# EAGLE design DP6037_SMT.v1 (EAGLE 5.07)
PROJECT: DP6037 SMD v1
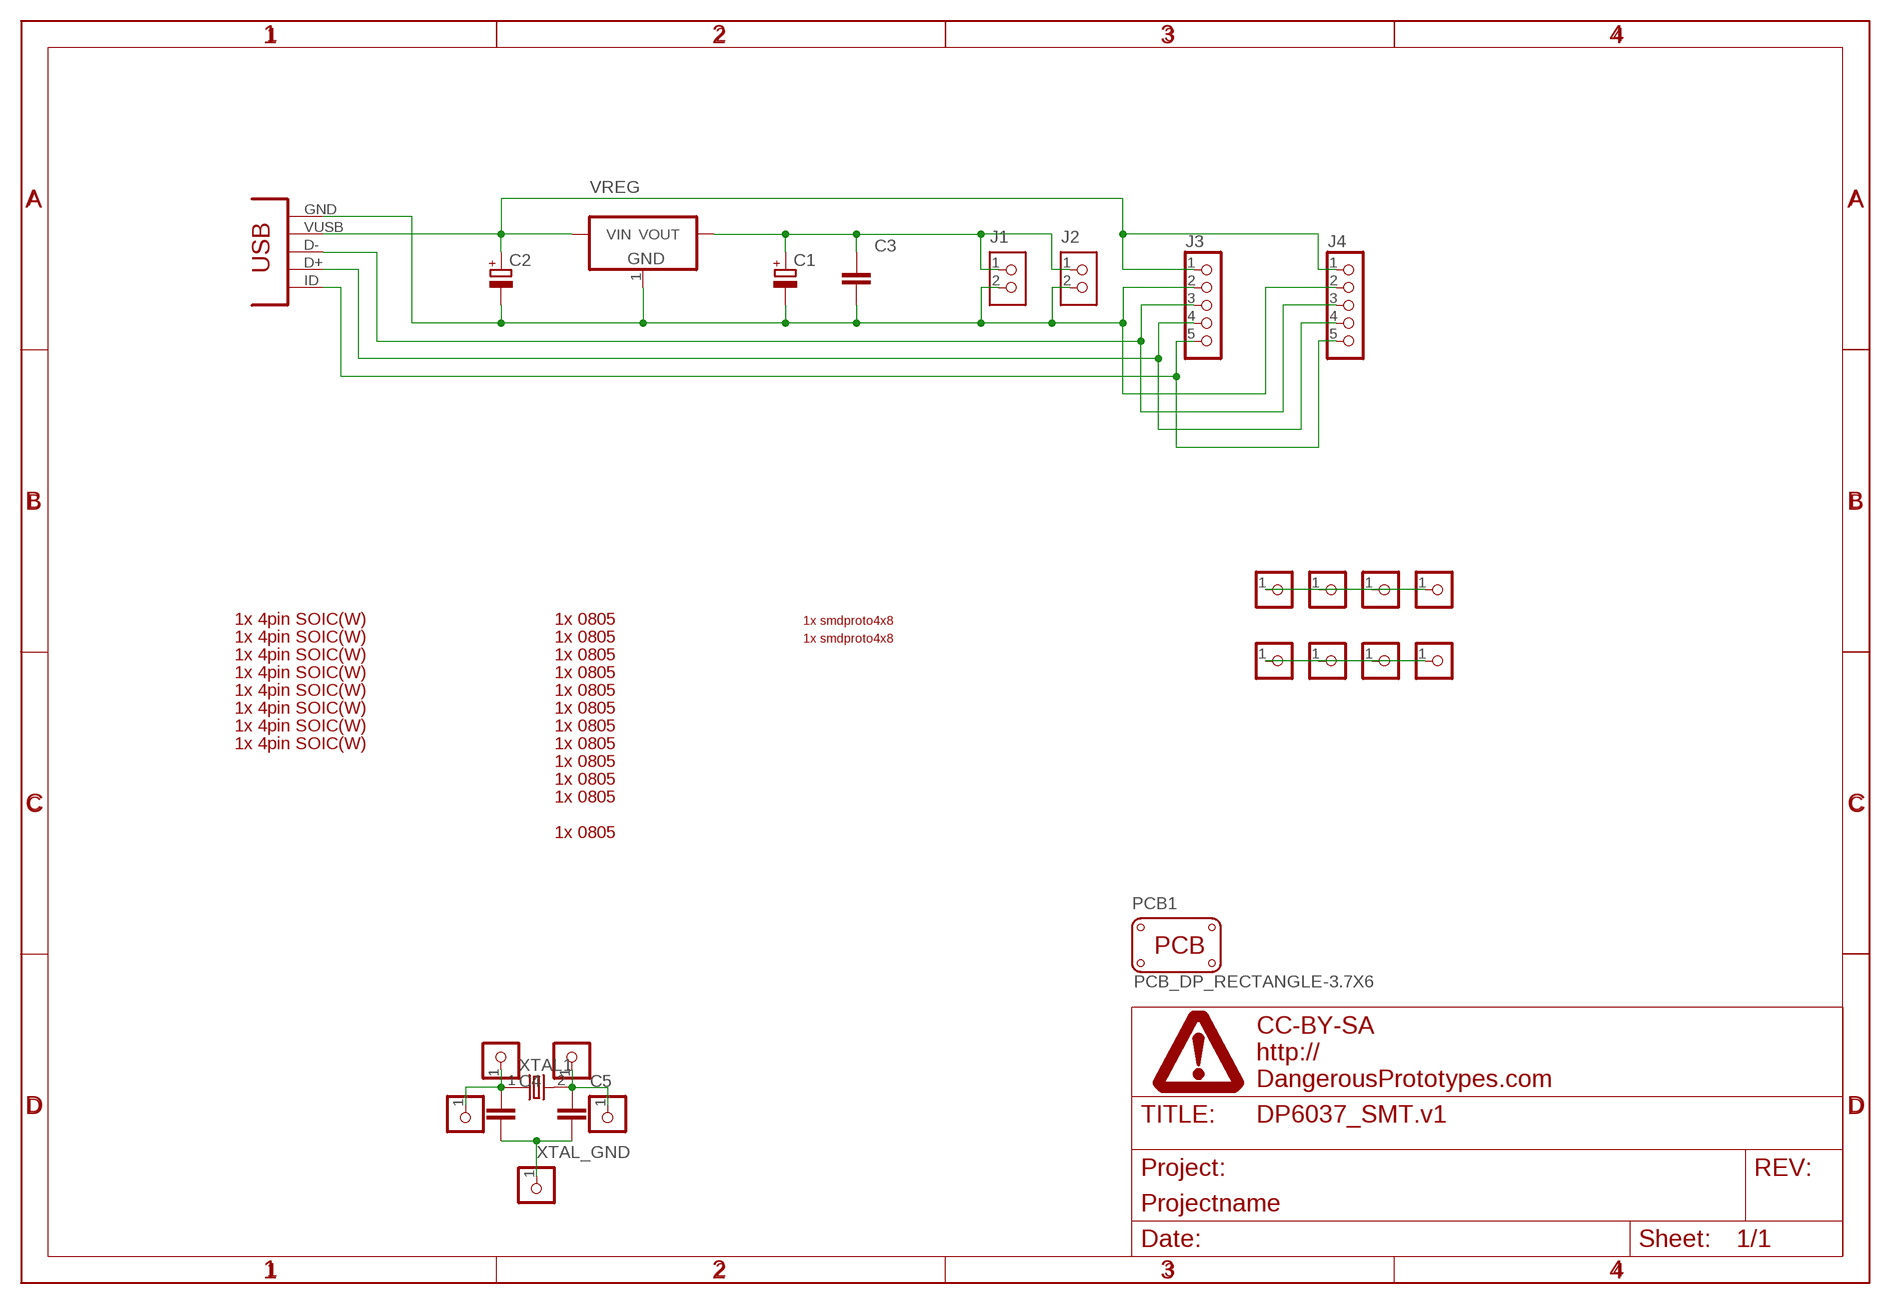
[diagram p0: schematic, sheet 1]

## Parts
C1  CAPACITOR_POL-SMC_A  [SMC_A]
C2  CAPACITOR_POL-SMC_A  [SMC_A]
C3  CAPACITOR_NPOL-0805  [C805]
C4  CAPACITOR_NPOL-0805  [C805]
C5  CAPACITOR_NPOL-0805  [C805]
J1  CON_HEADER_1X02-PTH  [M1X2]
J2  CON_HEADER_1X02-PTH  [M1X2]
J3  CON_HEADER_1X05-PTH  [M1X5]
J4  CON_HEADER_1X05-PTH  [M1X5]
J5  CON_HEADER_1X01-PTH  [M1X1]
J6  CON_HEADER_1X01-PTH  [M1X1]
J7  CON_HEADER_1X01-PTH  [M1X1]
J8  CON_HEADER_1X01-PTH  [M1X1]
J9  CON_HEADER_1X01-PTH  [M1X1]
J10  CON_HEADER_1X01-PTH  [M1X1]
J11  CON_HEADER_1X01-PTH  [M1X1]
J12  CON_HEADER_1X01-PTH  [M1X1]
J13  CON_HEADER_1X01-PTH_10_17  [M1X2_10_17]
J14  CON_HEADER_1X01-PTH_10_17  [M1X2_10_17]
J15  CON_HEADER_1X01-PTH_10_17  [M1X2_10_17]
J16  CON_HEADER_1X01-PTH_08_17  [M1X2_08_17]
J17  CON_HEADER_1X01-PTH_08_17  [M1X2_08_17]
PCB1  PCB_DP_RECTANGLE-3.7X6  PCB_DP_RECTANGLE-37X60  [DP6037_V1]
U$1  FRAME_DINA4_L  [DP_LOGO]
U$3  BB_SOICW  [BB_SOIC]
U$4  BB_SOICW  [BB_SOIC]
U$5  BB_SOICW  [BB_SOIC]
U$6  BB_SOICW  [BB_SOIC]
U$7  BB_SOICW  [BB_SOIC]
U$8  BB_SOICW  [BB_SOIC]
U$9  BB_SOICW  [BB_SOIC]
U$10  BB_SOICW  [BB_SOIC]
U$12  SMDPROTO4X8  [SMDPROTO4X8]
U$13  SMDPROTO4X8  [SMDPROTO4X8]
U$14  BB_RC0805  [BB_RC0805]
U$15  BB_RC0805  [BB_RC0805]
U$16  BB_RC0805  [BB_RC0805]
U$17  BB_RC0805  [BB_RC0805]
U$18  BB_RC0805  [BB_RC0805]
U$19  BB_RC0805  [BB_RC0805]
U$20  BB_RC0805  [BB_RC0805]
U$21  BB_RC0805  [BB_RC0805]
U$22  BB_RC0805  [BB_RC0805]
U$23  BB_RC0805  [BB_RC0805]
U$24  BB_RC0805  [BB_RC0805]
U$25  BB_RC0805  [BB_RC0805]
USB1  CON-USB-F-MINI-B  [CONN_USB_MINI-B]
VREG  IC_VREG_3PINS-SOT-223  [SOT-223]
XTAL1  OSC-XTAL-HC-49U-SMD  [HC-49U]

## Nets
N$1: J5.1 J6.1 J7.1 J8.1
N$2: C1.+ C3.1 J1.1 J2.1 VREG.2(VOUT)
N$3: C1.- C2.- C3.2 J1.2 J2.2 J3.2 J4.2 USB1.GND VREG.1(GND)
N$4: C2.+ J3.1 J4.1 USB1.VUSB VREG.3(VIN)
N$5: J9.1 J10.1 J11.1 J12.1
N$6: C4.1 J13.1 J16.1 XTAL1.1
N$7: C5.1 J14.1 J17.1 XTAL1.2
N$11: J3.3 J4.3 USB1.D-
N$14: J3.4 J4.4 USB1.D+
N$16: J3.5 J4.5 USB1.ID(USBID)
XTAL_GND: C4.2 C5.2 J15.1
Unconnected: USB1.BODY@1(BODY) USB1.BODY@2(BODY) USB1.BODY@3(BODY) USB1.BODY@4(BODY)

## Library data of the parts
C1 C2 = dp_devices:CAPACITOR_POL: Polarized capacitor in various packages
C3-C5 = dp_devices:CAPACITOR_NPOL: Non-Polarized capacitor in various packages
J1 J2 = dp_devices:CON_HEADER_1X02
J3 J4 = dp_devices:CON_HEADER_1X05
J5-J17 = dp_devices:CON_HEADER_1X01
PCB1 = dp_devices:PCB_DP_RECTANGLE: Dangerous Prototypes Standard Rectangular PCB sizes
U$1 = dp_devices:FRAME_DINA4_L: A4 DP frame Standard Dangerous Prototypes schematic frame. Automagically adds the DP logo and standard texts to the PCB Use the atrribute in the schematic editor to change the fields.; FF1: fulfillment by; FF2: Seeed Studio; FF3: www.seeedstudio.com; LICENSE: CC-BY-SA; PROJECT: Projectname; URL1: http://; URL2: DangerousPrototypes.com
U$3-U$10 = DP_protoboard:BB_SOICW
U$12 U$13 = DP_protoboard:SMDPROTO4X8
U$14-U$25 = DP_protoboard:BB_RC0805
USB1 = dp_devices:CON-USB-F: USB Female connector
VREG = dp_devices:IC_VREG_3PINS: Various 3 pin voltage regulators in different packages Double check the right pinout for the right part
XTAL1 = dp_devices:OSC-XTAL

## Board
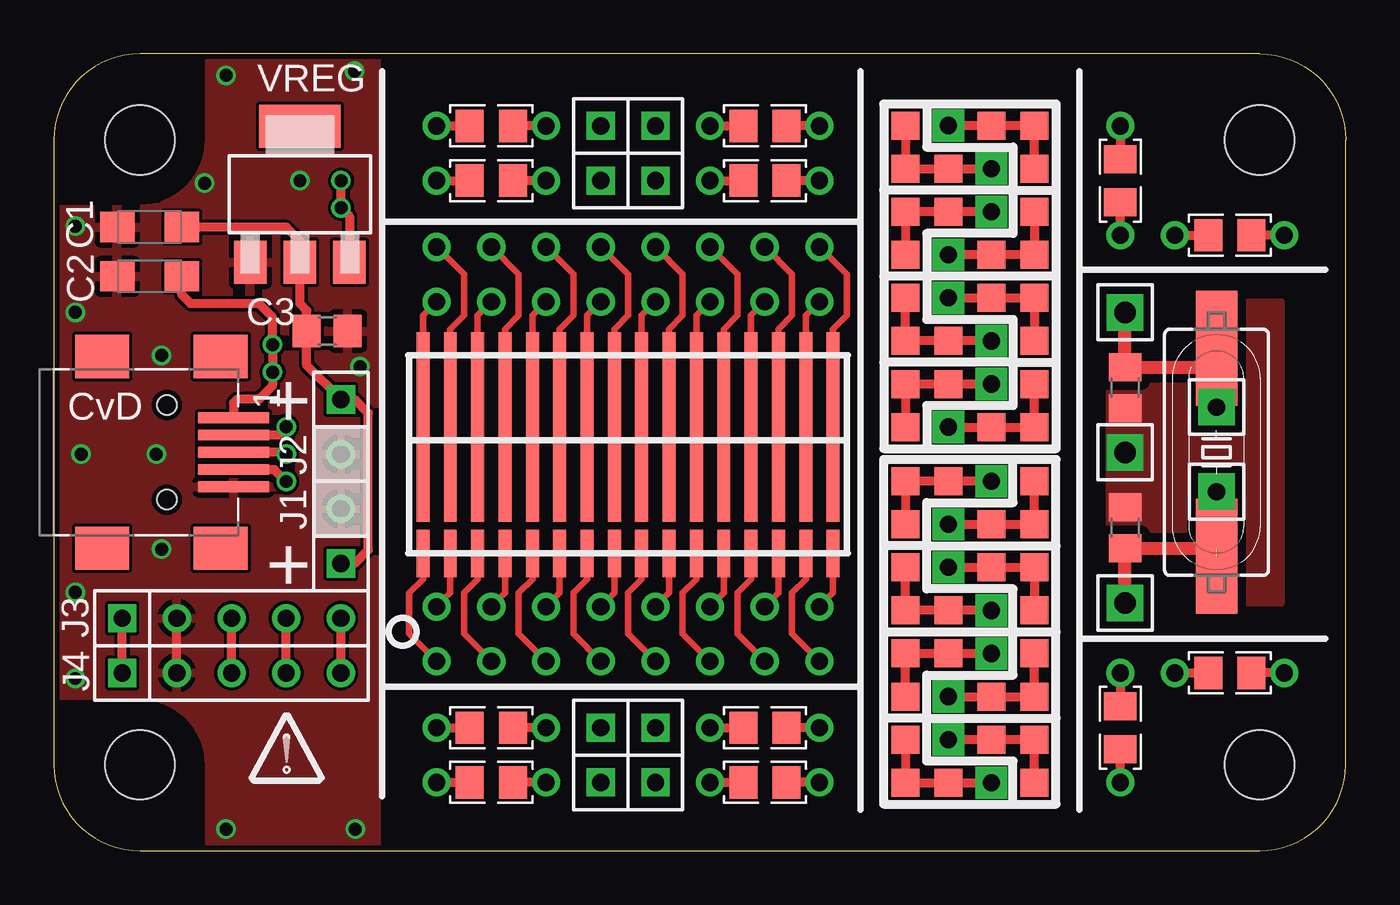
[diagram p1: board, top side]
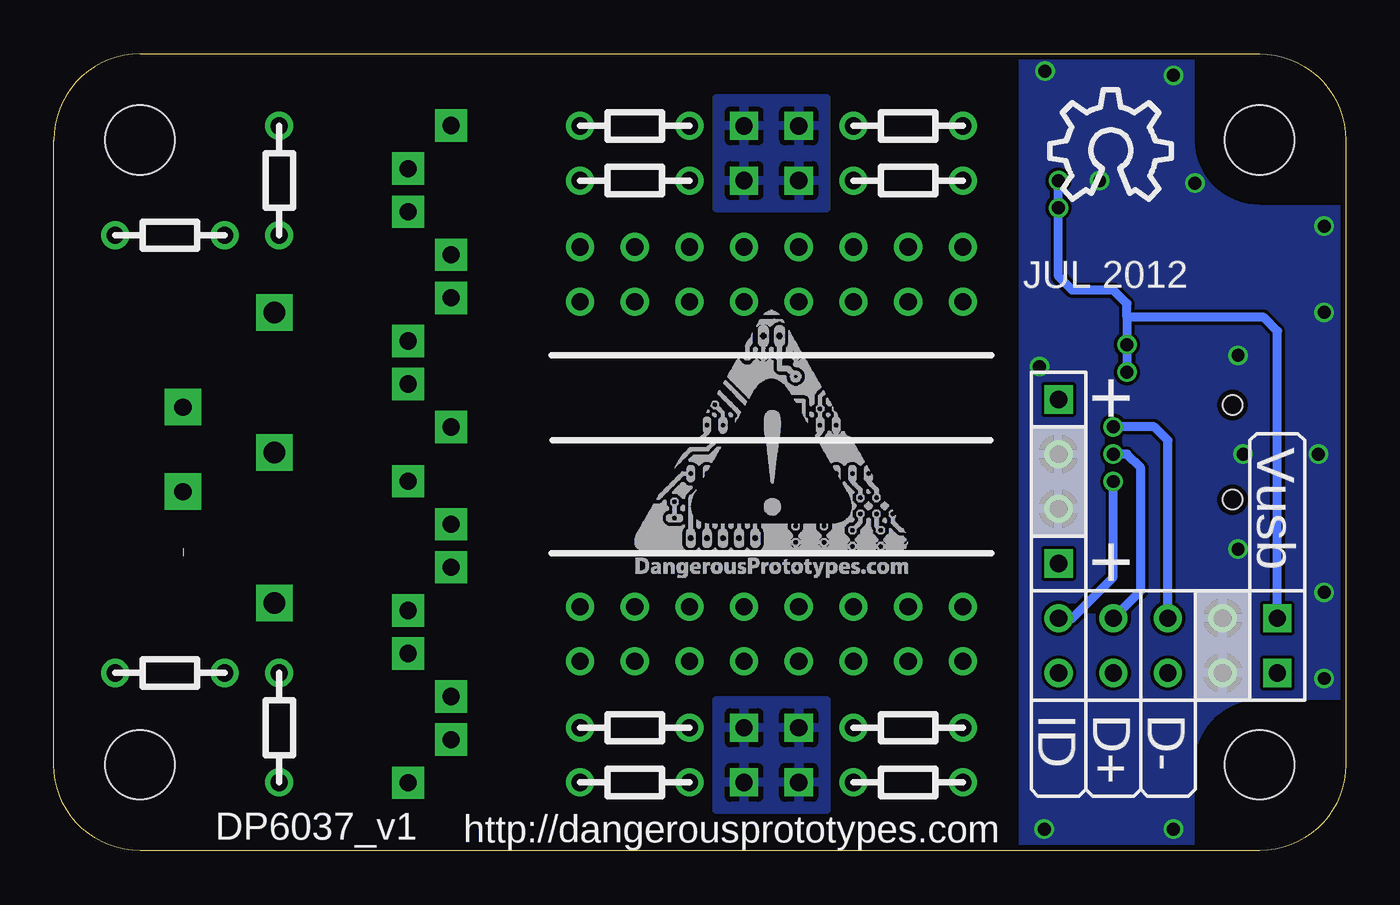
[diagram p2: board, bottom side, seen from below]

Size 60 x 37 mm. Coordinates in mm from the lower left corner, seen from the top.
Copper layers (1*16): Top 0.035mm / dielectric 1.5mm / Bottom 0.035mm
Design rules "Fusion_eagle_rule_v1.1": minimum track width 6mil, minimum drill 12mil, track to track 6mil, track to pad 6mil, pad to pad 6mil, via to via 6mil, smd to smd 0mil, copper to edge 10mil, drill to drill 10mil, minimum pad ring 10mil, minimum via ring 6mil, stop-mask expansion 2mil, vias tented up to drill 100mil, thermal gap 10mil

### Footprints (pad centres in the part's own frame; a part is rotated, then mirrored left to right if it is on the bottom)
SMC_A = smd 1.6 x 1.4: + -1.5,0; - 1.5,0
C805 = smd 1.3 x 1.5: 1 -0.95,0; 2 0.95,0
M1X2 = drill 0.8 square: 1 -1.27,0 | drill 0.8 round: 2 1.27,0
M1X5 = drill 0.8 square: 1 -5.08,0 | drill 0.8 round: 2 -2.54,0; 3 0,0; 4 2.54,0; 5 5.08,0
M1X1 = drill 0.8 square: 1 0,0
M1X2_10_17 = drill 1 pad 1.7 square: 1 0,0
M1X2_08_17 = drill 0.8 pad 1.7 square: 1 0,0
DP6037_V1 = hole 3.2: 4,4; 56,4; 56,33; 4,33
BB_SOIC = smd 2.2 x 0.6: P$1 -4.61,0.635; P$2 -4.61,-0.635 | smd 8.8 x 0.6: P$3 1.27,-0.635; P$4 1.27,0.635 | drill 0.8 round: P$5 -7.08,0; P$6 -9.62,0; P$7 7.08,0; P$8 9.62,0
SMDPROTO4X8 = smd 1.3 x 1.3: P$1 -1,1; P$3 1,1; P$5 -3,-1; P$6 -5,-1; P$8 3,-1; P$9 5,-1; P$11 7,1; P$16 -7,1; P$17 7,3; P$18 5,3; P$19 3,3; P$20 1,3; P$21 -1,3; P$22 -3,3; P$23 -5,3; P$24 -7,3; P$25 -7,-3; P$26 -5,-3; P$27 -3,-3; P$28 -1,-3; P$29 1,-3; P$30 3,-3; P$31 5,-3; P$32 7,-3 | drill 0.8 pad 1.5 square: P$2 -5,1; P$4 -7,-1; P$7 -3,1; P$10 -1,-1; P$12 1,-1; P$13 3,1; P$14 5,1; P$15 7,-1
BB_RC0805 = smd 1.3 x 1.5: P$1 -1,0; P$2 1,0 | drill 0.8 round: P$3 -2.54,0; P$4 2.54,0
CONN_USB_MINI-B = smd 2 x 2.5: BODY@1 -4.45,2.5; BODY@2 4.45,2.5; BODY@3 4.45,-3; BODY@4 -4.45,-3 | smd 0.5 x 3.3: D+ 0,3.1; D- -0.8,3.1; GND 1.6,3.1; ID 0.8,3.1; VUSB -1.6,3.1 | hole 0.9: -2.2,0; 2.2,0
SOT-223 = smd 1.5 x 2: 1 -2.3,-3.15; 2 0,-3.15; 3 2.3,-3.15 | smd 3.8 x 2: 4 0,3.15
HC-49U = smd 5.334 x 1.93: 1 -4.826,0; 2 4.826,0

### Placement (x,y rotation side)
C1  4.45,28.96 180 top
C2  4.45,26.67 180 top
C3  12.7,24.13 0 top
C4  49.75,15 90 top
C5  49.75,21.5 270 top
J1  13.34,14.61 90 top
J2  13.34,19.68 270 top
J3  8.26,10.79 0 top
J4  8.26,8.26 0 top
J5  27.94,31.11 0 top
J6  27.94,33.66 0 top
J7  25.4,33.66 0 top
J8  25.4,31.11 0 top
J9  25.4,3.17 0 top
J10  25.4,5.71 0 top
J11  27.94,3.17 0 top
J12  27.94,5.71 0 top
J13  49.75,11.5 0 top
J14  49.75,25 0 top
J15  49.75,18.5 0 top
J16  54,16.67 0 top
J17  54,20.6 0 top
PCB1  0,0 0 top
U$1  10.81,3.76 0 top
U$2  [DP_LOGO_ART_0.5X0.5]  33.02,12.7 0 bottom
U$3  35.56,18.41 90 top
U$4  30.48,18.41 90 top
U$5  20.32,18.41 90 top
U$6  17.78,18.41 90 top
U$7  25.4,18.41 90 top
U$8  33.02,18.41 90 top
U$9  27.94,18.41 90 top
U$10  22.86,18.41 90 top
U$12  42.55,26.67 270 top
U$13  42.55,10.16 90 top
U$14  49.53,31.11 90 top
U$15  54.61,28.57 180 top
U$16  20.32,33.66 180 top
U$17  33.02,33.66 180 top
U$18  20.32,31.11 0 top
U$19  33.02,31.11 180 top
U$20  20.32,5.71 0 top
U$21  20.32,3.17 0 top
U$22  33.02,5.71 0 top
U$23  33.02,3.17 0 top
U$24  49.53,5.71 90 top
U$25  54.61,8.26 0 top
U$26  [OSHW_10X200_NOTEXT]  13.75,30.25 0 bottom
USB1  5.25,18.5 270 top
VREG  11.43,30.48 0 top
XTAL1  54,18.5 90 top

### Tracks (layer width: path | path; a pad name or v marks a point on that pad's centre or on a via)
N$1
  pour Bottom: 24.13,34.92 29.21,34.92 29.21,29.84 24.13,29.84
N$2
  Top 0.406: J1.1 13.97,13.34 14.61,13.97 14.61,20.32 13.97,20.95 J2.1 11.75,22.54 C3.1 11.75,25.08 11.43,25.4 VREG.2 11.43,28.32 10.79,28.96 C1.+
N$3  (via drill 0.6)
  Top 0.406: J4.2 J3.2
  other vias: 14,1 8,1 1,8 1,12 5,14 5,23 1.27,18.41 1,25 1,29 13.97,36.2 8,36 7,31 11.43,31.11 14.22,22.48 4.76,18.41
  pour Top: 15,37 0,37 0,0 15,0
  pour Bottom: 15,0 0,0 0,37 15,37
N$4  (via drill 0.6)
  Top 0.406: J4.1 J3.1 | USB1.VUSB 8.35,20.8 8.51,20.95 9.53,20.95 10.16,21.59 v10.16,22.23 v10.16,23.5 10.16,24.77 9.53,25.4 6.35,25.4 5.95,25.8 C2.+ | v13.34,31.11 v13.34,29.84 13.73,29.45 VREG.3
  Bottom 0.406: v10.16,22.23 v10.16,23.5 10.16,24.77 | 10.16,24.77 10.16,25.4 10.79,26.04 12.7,26.04 13.34,26.67 v13.34,29.84 v13.34,31.11 | J3.1 3.17,24.13 3.81,24.77 10.16,24.77
N$5
  pour Bottom: 24.13,6.99 24.13,1.91 29.21,1.91 29.21,6.99
N$6  (1 unrouted)
  Top 0.61: J13.1 C4.1 54,14.05 54,13.05 | J16.1 XTAL1.1 54,13.5
N$7
  Top 0.61: XTAL1.2 54,22.45 C5.1 J14.1 | XTAL1.2 J17.1 | XTAL1.2 54,23.45
N$11  (via drill 0.6)
  Top 0.406: J4.3 J3.3 | USB1.D- 10.41,19.3 v10.79,19.68
  Bottom 0.406: J3.3 8.26,19.05 8.89,19.68 v10.79,19.68
N$14  (via drill 0.6)
  Top 0.406: J4.4 J3.4 | USB1.D+ 10.71,18.5 v10.79,18.41
  Bottom 0.406: J3.4 9.53,12.06 9.53,17.78 10.16,18.41 v10.79,18.41
N$16  (via drill 0.6)
  Top 0.406: J4.5 J3.5 | USB1.ID 10.24,17.7 v10.79,17.14
  Bottom 0.406: v10.79,17.14 10.79,12.7 12.7,10.79 J3.5
XTAL_GND
  pour Top (isolate 0.406, no thermals): 49,25.5 57,25.5 57,11.5 49,11.5

### Text on the board
tPlace: CvD | + | +
bPlace: JUL 2012 | + | Vusb | + | D- | D+ | ID | http://dangerousprototypes.com